# EAGLE design ADS1298_V1 (EAGLE 9.6.1)
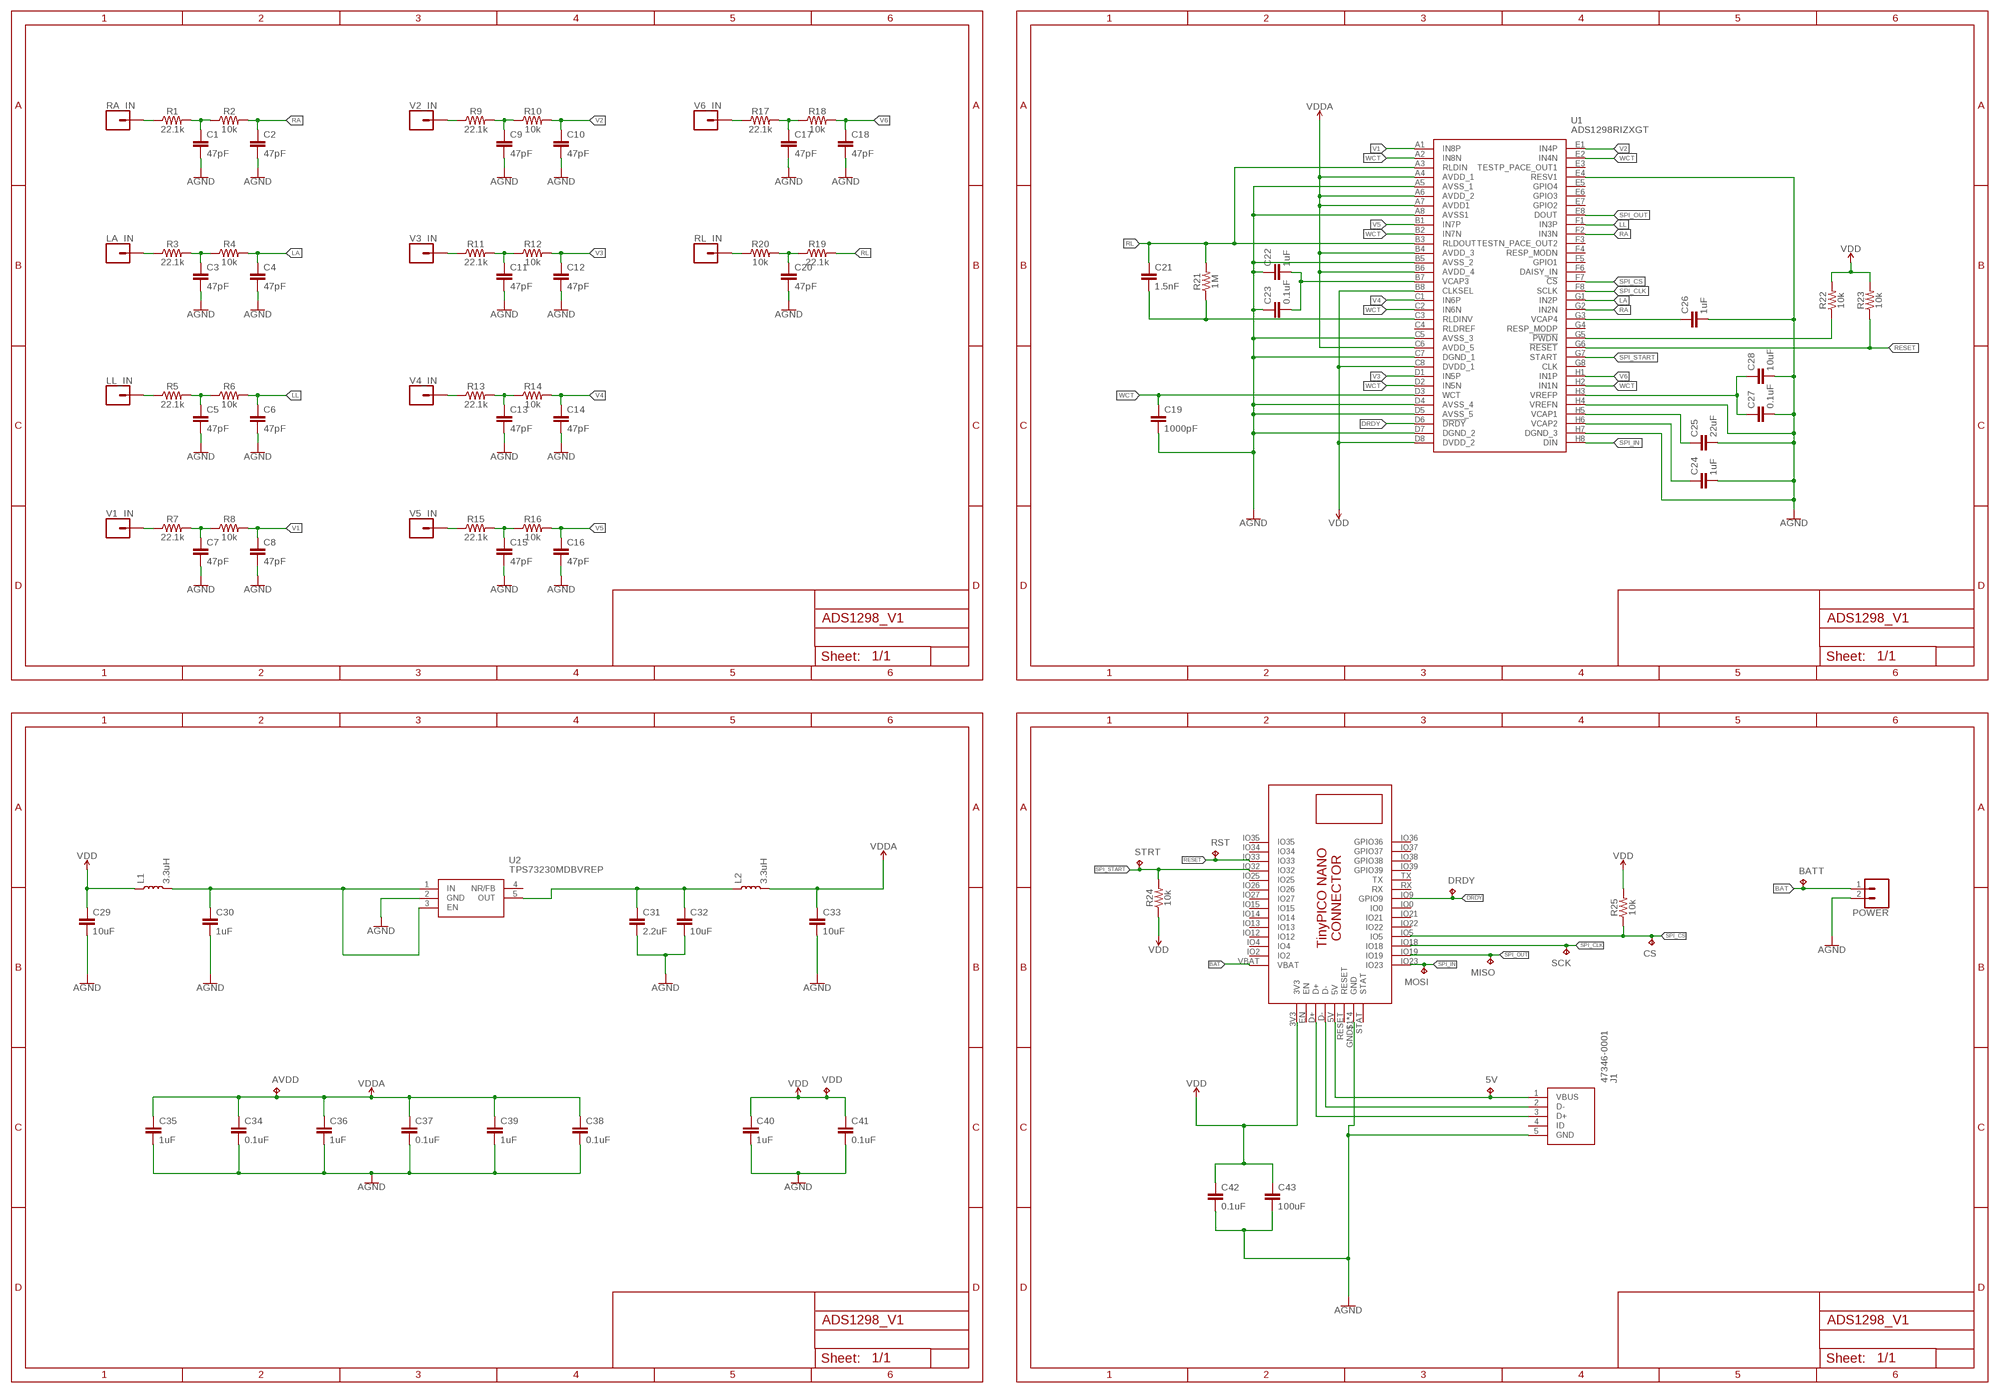
[diagram p0: schematic, sheet 1]

## Parts
5V  TPB1,27  [B1,27]
AVDD  TPB1,27  [B1,27]
BATT  TPB1,27  [B1,27]
C1  47pF  CAP-0603  [0603]
C2  47pF  CAP-0603  [0603]
C3  47pF  CAP-0603  [0603]
C4  47pF  CAP-0603  [0603]
C5  47pF  CAP-0603  [0603]
C6  47pF  CAP-0603  [0603]
C7  47pF  CAP-0603  [0603]
C8  47pF  CAP-0603  [0603]
C9  47pF  CAP-0603  [0603]
C10  47pF  CAP-0603  [0603]
C11  47pF  CAP-0603  [0603]
C12  47pF  CAP-0603  [0603]
C13  47pF  CAP-0603  [0603]
C14  47pF  CAP-0603  [0603]
C15  47pF  CAP-0603  [0603]
C16  47pF  CAP-0603  [0603]
C17  47pF  CAP-0603  [0603]
C18  47pF  CAP-0603  [0603]
C19  1000pF  CAP-0603  [0603]
C20  47pF  CAP-0603  [0603]
C21  1.5nF  CAP-0603  [0603]
C22  1uF  CAP-0603  [0603]
C23  0.1uF  CAP-0603  [0603]
C24  1uF  CAP-0603  [0603]
C25  22uF  CAP-0805  [0805]
C26  1uF  CAP-0603  [0603]
C27  0.1uF  CAP-0603  [0603]
C28  10uF  CAP-0805  [0805]
C29  10uF  CAP-0805  [0805]
C30  1uF  CAP-0603  [0603]
C31  2.2uF  CAP-0603  [0603]
C32  10uF  CAP-0805  [0805]
C33  10uF  CAP-0805  [0805]
C34  0.1uF  CAP-0603  [0603]
C35  1uF  CAP-0603  [0603]
C36  1uF  CAP-0603  [0603]
C37  0.1uF  CAP-0603  [0603]
C38  0.1uF  CAP-0603  [0603]
C39  1uF  CAP-0603  [0603]
C40  1uF  CAP-0603  [0603]
C41  0.1uF  CAP-0603  [0603]
C42  0.1uF  CAP-0603  [0603]
C43  100uF  CAP-0805  [0805]
CS  TPB1,27  [B1,27]
DRDY  TPB1,27  [B1,27]
J1  47346-0001  [47346-0001]
L1  3.3uH  INDUCTOR-0805-3.3UH  [0805]
L2  3.3uH  INDUCTOR-0805-3.3UH  [0805]
LA_IN  CONN_01  [1X01]
LL_IN  CONN_01  [1X01]
MISO  TPB1,27  [B1,27]
MOSI  TPB1,27  [B1,27]
POWER  CONN_02  [1X02]
R1  22.1k  RESISTOR0603  [0603]
R2  10k  RESISTOR0603  [0603]
R3  22.1k  RESISTOR0603  [0603]
R4  10k  RESISTOR0603  [0603]
R5  22.1k  RESISTOR0603  [0603]
R6  10k  RESISTOR0603  [0603]
R7  22.1k  RESISTOR0603  [0603]
R8  10k  RESISTOR0603  [0603]
R9  22.1k  RESISTOR0603  [0603]
R10  10k  RESISTOR0603  [0603]
R11  22.1k  RESISTOR0603  [0603]
R12  10k  RESISTOR0603  [0603]
R13  22.1k  RESISTOR0603  [0603]
R14  10k  RESISTOR0603  [0603]
R15  22.1k  RESISTOR0603  [0603]
R16  10k  RESISTOR0603  [0603]
R17  22.1k  RESISTOR0603  [0603]
R18  10k  RESISTOR0603  [0603]
R19  22.1k  RESISTOR0603  [0603]
R20  10k  RESISTOR0603  [0603]
R21  1M  RESISTOR0603  [0603]
R22  10k  RESISTOR0603  [0603]
R23  10k  RESISTOR0603  [0603]
R24  10k  RESISTOR0603  [0603]
R25  10k  RESISTOR0603  [0603]
RA_IN  CONN_01  [1X01]
RL_IN  CONN_01  [1X01]
RST  TPB1,27  [B1,27]
SCK  TPB1,27  [B1,27]
STRT  TPB1,27  [B1,27]
U1  ADS1298RIZXGT  [BGA64C80P8X8_800X800X145]
U2  TPS73230MDBVREP  [SOT95P280X145-5N]
U3  TINYPICO-NANO-CONNECTOR  [TINYPICO-NANO-CONNECTOR]
V1_IN  CONN_01  [1X01]
V2_IN  CONN_01  [1X01]
V3_IN  CONN_01  [1X01]
V4_IN  CONN_01  [1X01]
V5_IN  CONN_01  [1X01]
V6_IN  CONN_01  [1X01]
VDD  TPB1,27  [B1,27]

## Nets
AGND: C1.2 C2.2 C3.2 C4.2 C5.2 C6.2 C7.2 C8.2 C9.2 C10.2 C11.2 C12.2 C13.2 C14.2 C15.2 C16.2 C17.2 C18.2 C19.2 C20.2 C22.1 C23.1 C24.2 C25.2 C26.2 C27.2 C28.2 C29.2 C30.2 C31.2 C32.2 C33.2 C34.2 C35.2 C36.2 C37.2 C38.2 C39.2 C40.2 C41.2 C42.2 C43.2 J1.5(GND) POWER.2 U1.A5(AVSS_1) U1.A8(AVSS1) U1.B5(AVSS_2) U1.C5(AVSS_3) U1.C7(DGND_1) U1.D4(AVSS_4) U1.D5(AVSS_5) U1.D7(DGND_2) U1.E4(RESV1) U1.H4(VREFN) U1.H7(DGND_3) U2.2(GND) U3.GND$1(GND) U3.GND$2(GND) U3.GND$3(GND) U3.GND$4(GND)
BAT: BATT.TP POWER.1 U3.VBAT
DRDY: DRDY.TP U1.D6(!DRDY) U3.IO9(GPIO9)
LA: C4.1 R4.2 U1.G1(IN2P)
LL: C6.1 R6.2 U1.F1(IN3P)
N$1: R1.1 RA_IN.1
N$2: C1.1 R1.2 R2.1
N$3: LA_IN.1 R3.1
N$4: C3.1 R3.2 R4.1
N$5: LL_IN.1 R5.1
N$6: C5.1 R5.2 R6.1
N$7: R7.1 V1_IN.1
N$8: C7.1 R7.2 R8.1
N$9: R9.1 V2_IN.1
N$10: C9.1 R9.2 R10.1
N$11: R11.1 V3_IN.1
N$12: C11.1 R11.2 R12.1
N$13: R13.1 V4_IN.1
N$14: C13.1 R13.2 R14.1
N$15: R15.1 V5_IN.1
N$16: C15.1 R15.2 R16.1
N$17: R17.1 V6_IN.1
N$18: C17.1 R17.2 R18.1
N$19: R20.1 RL_IN.1
N$20: C20.1 R19.1 R20.2
N$21: C21.2 R21.1 U1.C3(RLDINV)
N$22: C22.2 C23.2 U1.B7(VCAP3)
N$23: R22.1 U1.G5(!PWDN)
N$24: C24.1 U1.H6(VCAP2)
N$25: C27.1 C28.1 U1.H3(VREFP)
N$26: C25.1 U1.H5(VCAP1)
N$27: C26.1 U1.G3(VCAP4)
N$29: C31.1 C32.1 L2.1 U2.5(OUT)
N$30: J1.3(D+) U3.D+
N$31: J1.2(D-) U3.D-
N$32: 5V.TP J1.1(VBUS) U3.5V
N$33: C30.1 L1.2 U2.1(IN) U2.3(EN)
RA: C2.1 R2.2 U1.F2(IN3N) U1.G2(IN2N)
RESET: R23.1 RST.TP U1.G6(!RESET) U3.IO33
RL: C21.1 R19.2 R21.2 U1.A3(RLDIN) U1.B3(RLDOUT)
SPI_CLK: SCK.TP U1.F8(SCLK) U3.IO18
SPI_CS: CS.TP R25.1 U1.F7(!CS) U3.IO5
SPI_IN: MOSI.TP U1.H8(DIN) U3.IO23
SPI_OUT: MISO.TP U1.E8(DOUT) U3.IO19
SPI_START: R24.2 STRT.TP U1.G7(START) U3.IO32
V1: C8.1 R8.2 U1.A1(IN8P)
V2: C10.1 R10.2 U1.E1(IN4P)
V3: C12.1 R12.2 U1.D1(IN5P)
V4: C14.1 R14.2 U1.C1(IN6P)
V5: C16.1 R16.2 U1.B1(IN7P)
V6: C18.1 R18.2 U1.H1(IN1P)
VDD: C29.1 C40.1 C41.1 C42.1 C43.1 L1.1 R22.2 R23.2 R24.1 R25.2 U1.B8(CLKSEL) U1.C8(DVDD_1) U1.D8(DVDD_2) U3.3V3 VDD.TP
VDDA: AVDD.TP C33.1 C34.1 C35.1 C36.1 C37.1 C38.1 C39.1 L2.2 U1.A4(AVDD_1) U1.A6(AVDD_2) U1.A7(AVDD1) U1.B4(AVDD_3) U1.B6(AVDD_4) U1.C6(AVDD_5)
WCT: C19.1 U1.A2(IN8N) U1.B2(IN7N) U1.C2(IN6N) U1.D2(IN5N) U1.D3(WCT) U1.E2(IN4N) U1.H2(IN1N)
Unconnected: J1.4(ID) U1.C4(RLDREF) U1.E3(TESTP_PACE_OUT1) U1.E5(GPIO4) U1.E6(GPIO3) U1.E7(GPIO2) U1.F3(TESTN_PACE_OUT2) U1.F4(RESP_MODN) U1.F5(GPIO1) U1.F6(DAISY_IN) U1.G4(RESP_MODP) U1.G8(CLK) U2.4(NR/FB) U3.EN U3.IO0 U3.IO2 U3.IO4 U3.IO12 U3.IO13 U3.IO14 U3.IO15 U3.IO21 U3.IO22 U3.IO25 U3.IO26 U3.IO27 U3.IO34 U3.IO35 U3.IO36(GPIO36) U3.IO37(GPIO37) U3.IO38(GPIO38) U3.IO39(GPIO39) U3.RESET U3.RX U3.STAT U3.TX

## Library data of the parts
5V AVDD BATT CS DRDY MISO MOSI RST SCK STRT VDD = testpad:TP: Test pad
C1-C43 = SparkFun-Capacitors:CAP
J1 = 47346-0001:47346-0001: Micro USB B Receptacle Bottom Mount Assy Molex Right Angle SMT Type B Version 2.0 Micro USB Connector Socket, 30 V ac, 1A 47352 MICRO-USB Source: Datasheet <http://www.molex.com/pdm_docs/sd/473460001_sd.pdf>; DESCRIPTION: Micro USB B Receptacle Bottom Mount Assy Molex Right Angle SMT Type B Version 2.0 Micro USB Connector Socket, 30 V ac, 1A 47352 MICRO-USB; HEIGHT: mm; MANUFACTURER_NAME: Molex; MANUFACTURER_PART_NUMBER: 47346-0001; MOUSER_PART_NUMBER: 538-47346-0001; MOUSER_PRICE-STOCK: https://www.mouser.co.uk/ProductDetail/Molex/47346-0001?qs=c2CV6XM0DweJBWaSeyWeCw%3D%3D
L1 L2 = SparkFun-Coils:INDUCTOR: Inductors Resist changes in electrical current. Basically a coil of wire. SparkFun Products: SparkFun Load Cell Amplifier - HX711 <https://www.sparkfun.com/products/13879> IOIO-OTG - V2.2 <https://www.sparkfun.com/products/13613>; PROD_ID: NDUC-13076; VALUE: 3.3µH/±20%/450mA
LA_IN LL_IN RA_IN RL_IN V1_IN V2_IN V3_IN V4_IN V5_IN V6_IN = SparkFun-Connectors:CONN_01: Single connection point. Often used as Generic Header-pin footprint for 0.1 inch spaced/style header connections On any of the 0.1 inch spaced packages, you can populate with these: Break Away Headers - Straight <https://www.sparkfun.com/products/116> (PRT-00116) Break Away Male Headers - Right Angle <https://www.sparkfun.com/products/553> (PRT-00553) Female Headers <https://www.sparkfun.com/products/115> (PRT-00115) Break Away Headers - Machine Pin <https://www.sparkfun.com/products/117> (PRT-00117) Break Away Female Headers - Swiss Machine Pin <https://www.sparkfun.com/products/743> (PRT-00743) This device is also useful as a general connection point to wire up your design to another part of your project. Our various solder wires solder well into these plated through hole pads. Hook-Up Wire - Assortment (Stranded, 22 AWG) <https://www.sparkfun.com/products/11375> (PRT-11375) Hook-Up Wire - Assortment (Solid Core, 22 AWG) <https://www.sparkfun.com/products/11367> (PRT-11367) View the entire wire category on our website here <https://www.sparkfun.com/categories/141> Special notes: SMTSO-256-ET is a "flush mount" nut for a 4-40 screw. We mostly use this on specialty testbeds; it is a nice way to connect hardware to your PCB at an adjustable hieght. Also note, the SNAP packages are for using a snappable style connector. We sell a baggie of snaps and they are also used on two LilyPad designs: Snap Assortment - 30 pack (male and female) <https://www.sparkfun.com/products/11347> (DEV-11347) LilyPad Arduino SimpleSnap <https://www.sparkfun.com/products/10941> (DEV-10941) LilyPad SimpleSnap Protoboard <https://www.sparkfun.com/products/10940> (DEV-10940)
POWER = SparkFun-Connectors:CONN_02: Multi connection point. Often used as Generic Header-pin footprint for 0.1 inch spaced/style header connections On any of the 0.1 inch spaced packages, you can populate with these: Break Away Headers - Straight <https://www.sparkfun.com/products/116> (PRT-00116) Break Away Male Headers - Right Angle <https://www.sparkfun.com/products/553> (PRT-00553) Female Headers <https://www.sparkfun.com/products/115> (PRT-00115) Break Away Headers - Machine Pin <https://www.sparkfun.com/products/117> (PRT-00117) Break Away Female Headers - Swiss Machine Pin <https://www.sparkfun.com/products/743> (PRT-00743) For SCREWTERMINALS and SPRING TERMINALS visit here: Screw Terimnals on SparkFun.com <https://www.sparkfun.com/search/results?term=Screw+Terminals> (5mm/3.5mm/2.54mm spacing) This device is also useful as a general connection point to wire up your design to another part of your project. Our various solder wires solder well into these plated through hole pads. Hook-Up Wire - Assortment (Stranded, 22 AWG) <https://www.sparkfun.com/products/11375> (PRT-11375) Hook-Up Wire - Assortment (Solid Core, 22 AWG) <https://www.sparkfun.com/products/11367> (PRT-11367) View the entire wire category on our website here <https://www.sparkfun.com/categories/141> Special notes: Molex polarized connector foot print use with: PRT-08233 with associated crimp pins and housings. 2.54_SCREWTERM for use with PRT-10571. 3.5mm Screw Terminal footprints for PRT-08084 5mm Screw Terminal footprints for use with PRT-08432
R1-R25 = SparkFun-Resistors:RESISTOR: Generic Resistor Package
U1 = ADS1298RIZXGT:ADS1298RIZXGT: 8-Channel, 24-Bit Analog-To-Digital Converter w/Integrated Respiration Impedance and ECG Front End Source: Datasheet <http://www.ti.com/lit/gpn/ads1298r>; ARROW_PART_NUMBER: ADS1298RIZXGT; ARROW_PRICE-STOCK: https://www.arrow.com/en/products/ads1298rizxgt/texas-instruments; DESCRIPTION: 8-Channel, 24-Bit Analog-To-Digital Converter w/Integrated Respiration Impedance and ECG Front End; HEIGHT: 1.45mm; MANUFACTURER_NAME: Texas Instruments; MANUFACTURER_PART_NUMBER: ADS1298RIZXGT; MOUSER_PART_NUMBER: 595-ADS1298RIZXGT; MOUSER_PRICE-STOCK: https://www.mouser.co.uk/ProductDetail/Texas-Instruments/ADS1298RIZXGT/?qs=QtI0yD1FyOMXYlOc8kA39w%3D%3D
U2 = TPS73230MDBVREP:TPS73230MDBVREP: Enhanced Product Cap-Free Nmos 250-Ma Ldo Regulator With Reverse Current Protection Source: Datasheet <http://www.ti.com/lit/gpn/tps73230-ep>; ARROW_PART_NUMBER: TPS73230MDBVREP; ARROW_PRICE-STOCK: https://www.arrow.com/en/products/tps73230mdbvrep/texas-instruments; DESCRIPTION: Enhanced Product Cap-Free Nmos 250-Ma Ldo Regulator With Reverse Current Protection; HEIGHT: 1.45mm; MANUFACTURER_NAME: Texas Instruments; MANUFACTURER_PART_NUMBER: TPS73230MDBVREP; MOUSER_PART_NUMBER: 595-TPS73230MDBVREP; MOUSER_PRICE-STOCK: https://www.mouser.com/Search/Refine.aspx?Keyword=595-TPS73230MDBVREP
U3 = TinyPICO_NANO_Eagle:TINYPICO-NANO-CONNECTOR: TinyPICO NANO Footprint https://www.tinypico.com/tinypico-nano

## Board
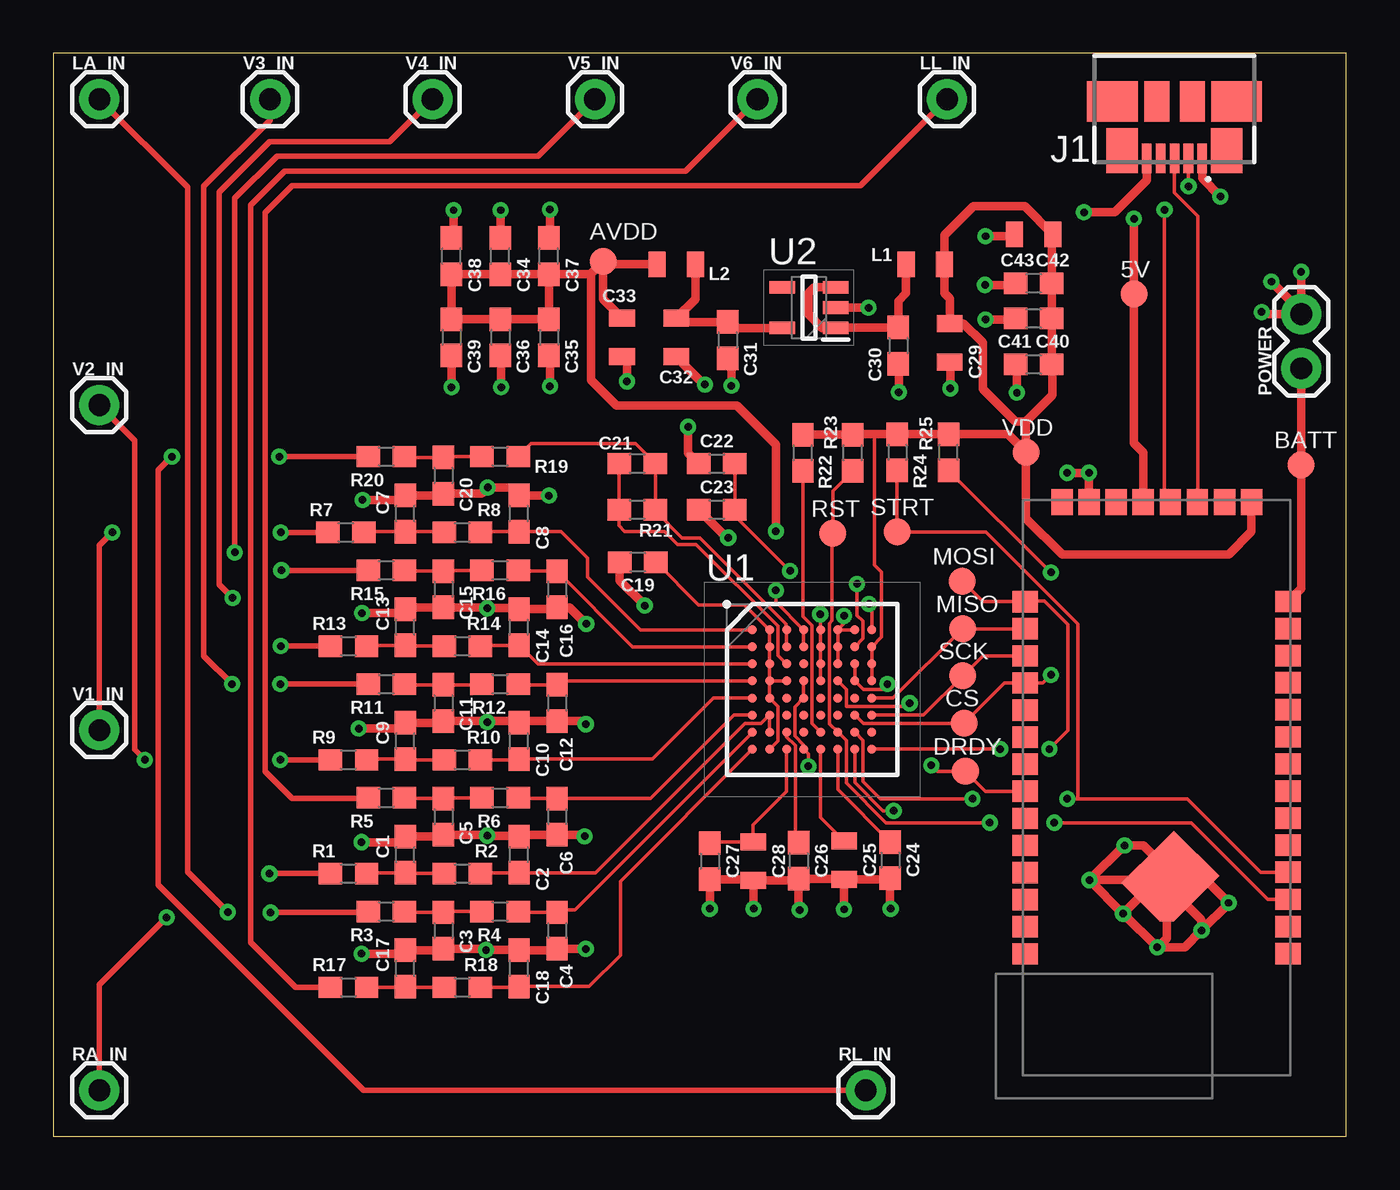
[diagram p1: board, top side]
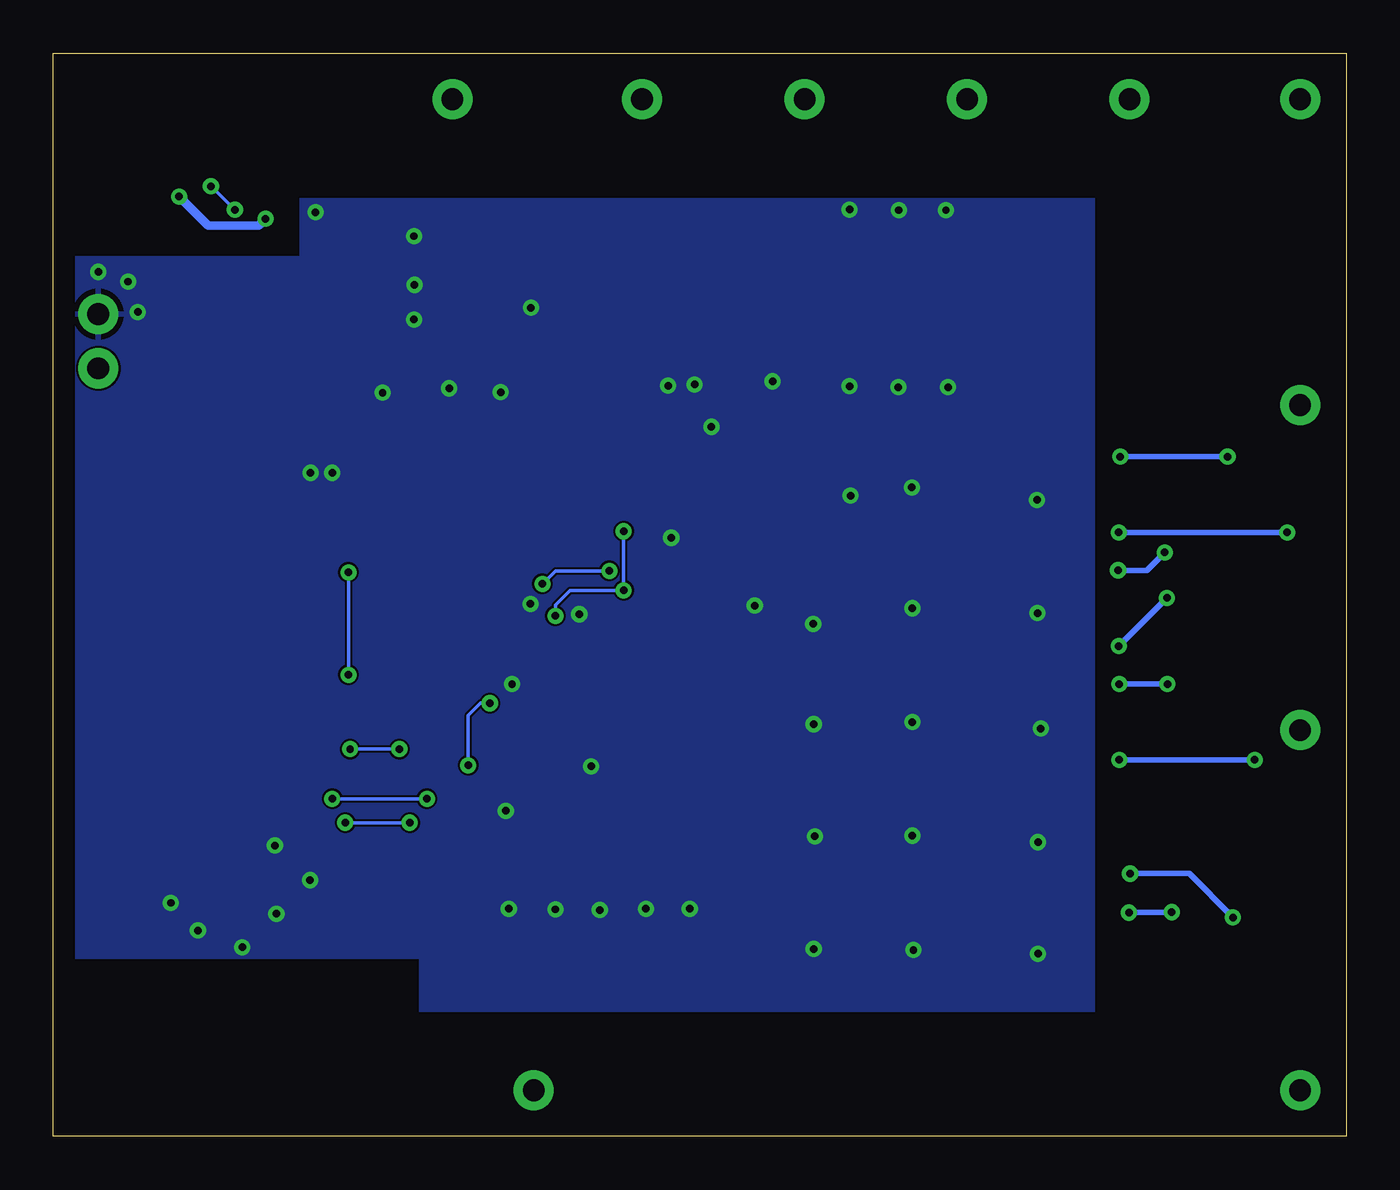
[diagram p2: board, bottom side, seen from below]

Size 60.63 x 50.79 mm. Coordinates in mm from the lower left corner, seen from the top.
Outline: 0,0 60.63,0 60.63,50.79 0,50.79 0,0
Copper layers (1*16): Top 0.035mm / dielectric 1.5mm / Bottom 0.035mm
Design rules "default *": minimum track width 6mil, minimum drill 0.35mm, track to track 4mil, track to pad 4mil, pad to pad 4mil, via to via 4mil, smd to smd 4mil, copper to edge 40mil, drill to drill 6mil, minimum pad ring 10mil, minimum via ring 8mil, stop-mask expansion 4mil, vias tented up to drill 0mil, thermal gap 10mil

### Footprints (pad centres in the part's own frame; a part is rotated, then mirrored left to right if it is on the bottom)
B1,27 = smd 1.27 x 1.27: TP 0,0
0603 = smd 1.1 x 1: 1 -0.85,0; 2 0.85,0
0805 = smd 0.8 x 1.2: 1 -0.9,0; 2 0.9,0
47346-0001 = smd 0.45 x 1.38: 1 1.3,-4.81; 2 0.65,-4.81; 3 0,-4.81; 4 -0.65,-4.81; 5 -1.3,-4.81 | smd 1.475 x 2.1: 6 -2.453,-4.45; 7 2.453,-4.45 | smd 1.175 x 1.9: 8 0.838,-2.15; 9 -0.838,-2.15 | smd 2.375 x 1.9: 10 2.913,-2.15; 11 -2.913,-2.15
1X01 = drill 1.016 pad 1.88: 1 0,0
1X02 = drill 1.016 pad 1.88: 1 0,0; 2 2.54,0
BGA64C80P8X8_800X800X145 = smd 0.418 x 0.418: A1 -2.8,2.8; A2 -2,2.8; A3 -1.2,2.8; A4 -0.4,2.8; A5 0.4,2.8; A6 1.2,2.8; A7 2,2.8; A8 2.8,2.8; B1 -2.8,2; B2 -2,2; B3 -1.2,2; B4 -0.4,2; B5 0.4,2; B6 1.2,2; B7 2,2; B8 2.8,2; C1 -2.8,1.2; C2 -2,1.2; C3 -1.2,1.2; C4 -0.4,1.2; C5 0.4,1.2; C6 1.2,1.2; C7 2,1.2; C8 2.8,1.2; D1 -2.8,0.4; D2 -2,0.4; D3 -1.2,0.4; D4 -0.4,0.4; D5 0.4,0.4; D6 1.2,0.4; D7 2,0.4; D8 2.8,0.4; E1 -2.8,-0.4; E2 -2,-0.4; E3 -1.2,-0.4; E4 -0.4,-0.4; E5 0.4,-0.4; E6 1.2,-0.4; E7 2,-0.4; E8 2.8,-0.4; F1 -2.8,-1.2; F2 -2,-1.2; F3 -1.2,-1.2; F4 -0.4,-1.2; F5 0.4,-1.2; F6 1.2,-1.2; F7 2,-1.2; F8 2.8,-1.2; G1 -2.8,-2; G2 -2,-2; G3 -1.2,-2; G4 -0.4,-2; G5 0.4,-2; G6 1.2,-2; G7 2,-2; G8 2.8,-2; H1 -2.8,-2.8; H2 -2,-2.8; H3 -1.2,-2.8; H4 -0.4,-2.8; H5 0.4,-2.8; H6 1.2,-2.8; H7 2,-2.8; H8 2.8,-2.8
SOT95P280X145-5N = smd 1.2 x 0.6: 1 -1.25,0.95; 2 -1.25,0; 3 -1.25,-0.95; 4 1.25,-0.95; 5 1.25,0.95
TINYPICO-NANO-CONNECTOR = smd 1.2 x 1: 3V3 0.1,10.725; 5V 0.1,5.645; D+ 0.1,8.185; D- 0.1,6.915; EN 0.1,9.455; GND$1 0.1,3.105; RESET 0.1,4.375; STAT 0.1,1.835 | smd 3 x 3 rotated 45: GND$2 17.643,7.082 | smd 0.66 x 0.671: GND$3 19.436,6.746 | smd 2.54 x 2.54 rotated 45: GND$4 17.971,6.413 | smd 1 x 1.2: IO0 12.395,0.1; IO2 6.034,12.44; IO4 7.304,12.44; IO5 8.585,0.1; IO9 13.665,0.1; IO12 8.574,12.44; IO13 9.844,12.44; IO14 11.114,12.44; IO15 12.384,12.44; IO18 7.315,0.1; IO19 6.045,0.1; IO21 11.125,0.1; IO22 9.855,0.1; IO23 4.775,0.1; IO25 16.194,12.44; IO26 14.924,12.44; IO27 13.654,12.44; IO32 17.464,12.44; IO33 18.734,12.44; IO34 20.004,12.44; IO35 21.274,12.44; IO36 21.285,0.1; IO37 20.015,0.1; IO38 18.745,0.1; IO39 17.475,0.1; RX 14.935,0.1; TX 16.205,0.1; VBAT 4.764,12.44

### Placement (x,y rotation side)
5V  50.67,39.5 0 top
AVDD  25.78,41.02 0 top
BATT  58.52,31.5 0 top
C1  16.51,13.21 90 top
C2  21.84,13.21 90 top
C3  18.29,9.65 270 top
C4  23.62,9.65 270 top
C5  18.29,14.99 270 top
C6  23.62,14.99 270 top
C7  16.51,29.21 90 top
C8  21.84,29.21 90 top
C9  16.51,18.54 90 top
C10  21.84,18.54 90 top
C11  18.29,20.32 270 top
C12  23.62,20.32 270 top
C13  16.51,23.88 90 top
C14  21.84,23.88 90 top
C15  18.29,25.65 270 top
C16  23.62,25.65 270 top
C17  16.51,7.87 90 top
C18  21.84,7.87 90 top
C19  27.41,26.92 180 top
C20  18.29,30.99 270 top
C21  27.38,31.55 180 top
C22  31.11,31.55 0 top
C23  31.11,29.39 0 top
C24  39.24,12.95 270 top
C25  37.08,12.95 270 top
C26  34.95,12.93 270 top
C27  30.78,12.9 270 top
C28  32.82,12.9 270 top
C29  42.04,37.21 270 top
C30  39.62,37.08 270 top
C31  31.62,37.34 270 top
C32  29.21,37.47 270 top
C33  26.67,37.47 270 top
C34  20.95,41.27 90 top
C35  23.24,37.47 270 top
C36  20.95,37.47 270 top
C37  23.24,41.27 90 top
C38  18.67,41.27 90 top
C39  18.67,37.47 270 top
C40  45.97,36.2 180 top
C41  45.97,38.35 180 top
C42  45.97,40.01 180 top
C43  45.97,42.29 180 top
CS  42.72,19.38 0 top
DRDY  42.77,17.12 0 top
J1  52.58,50.67 0 top
L1  40.89,40.89 180 top
L2  29.21,40.89 180 top
LA_IN  2.16,48.64 0 top
LL_IN  41.91,48.64 0 top
MISO  42.65,23.8 0 top
MOSI  42.62,26.04 0 top
POWER  58.52,36.02 90 top
R1  13.84,12.32 0 top
R2  19.18,12.32 0 top
R3  15.62,10.54 0 top
R4  20.95,10.54 0 top
R5  15.62,15.88 0 top
R6  20.95,15.88 0 top
R7  13.72,28.32 0 top
R8  19.18,28.32 0 top
R9  13.84,17.65 0 top
R10  19.18,17.65 0 top
R11  15.62,21.21 0 top
R12  20.95,21.21 0 top
R13  13.84,22.99 0 top
R14  19.18,22.99 0 top
R15  15.62,26.54 0 top
R16  20.95,26.54 0 top
R17  13.84,6.99 0 top
R18  19.18,6.99 0 top
R19  20.95,31.88 0 top
R20  15.62,31.88 0 top
R21  27.38,29.39 0 top
R22  35.15,32.05 90 top
R23  37.49,32.05 90 top
R24  39.57,32.08 270 top
R25  41.99,32.08 90 top
RA_IN  2.16,2.16 0 top
RL_IN  38.1,2.16 0 top
RST  36.55,28.27 0 top
SCK  42.65,21.59 0 top
STRT  39.57,28.35 0 top
U1  35.59,20.95 0 top
U2  35.43,38.86 180 top
U3  45.47,29.84 270 top
V1_IN  2.16,19.05 0 top
V2_IN  2.16,34.29 0 top
V3_IN  10.16,48.64 0 top
V4_IN  17.78,48.64 0 top
V5_IN  25.4,48.64 0 top
V6_IN  33.02,48.64 0 top
VDD  45.62,32.08 0 top

### Tracks (layer width: path | path; a pad name or v marks a point on that pad's centre or on a via)
AGND  (via drill 0.35)
  Top 0.152: U1.D5 U1.C5 U1.B5 U1.A5 35.98,24.47 v35.97,24.49 | U1.D4 U1.E4 34.77,20.14 34.77,18.77 35.19,18.36 U1.H4 35.41,17.93 v35.41,17.35 | U1.H7 37.59,16.59 38.91,15.27 v39.41,15.27 | U1.C7 U1.D7 37.98,20.95 38.86,20.95 v39.12,21.21 | U1.A8 38.38,24.84 v38.25,24.97
  Top 0.406: v53.85,9.65 53.85,10.16 52.13,11.87 U3.GND$4 51.6,11.87 | v51.77,8.87 51.79,8.87 52.21,9.29 U3.GND$3 | v55.12,10.95 | v55.12,10.95 53.87,12.2 U3.GND$2 51.11,13.64 v50.24,13.64 50.22,13.64 v48.59,12.01 | v50.16,10.44 51.6,11.87 | v48.59,12.01 51.46,12.01 51.6,11.87 | v48.59,12.01 v50.16,10.44 | v50.16,10.44 50.19,10.44 v51.77,8.87 | v51.77,8.87 53.06,8.87 v53.85,9.65 | v53.85,9.65 55.12,10.93 v55.12,10.95 | C28.2 32.77,12.05 C27.2 v30.79,10.67 | C28.2 34.88,12 C26.2 | C26.2 37.06,12.08 C25.2 | C25.2 39.19,12.05 C24.2 39.24,10.69 v39.27,10.67 | C28.2 32.84,11.98 v32.84,10.67 | C26.2 34.95,10.67 v35,10.62 | C25.2 v37.08,10.64 | v24.97,8.79 24.95,8.8 C4.2 23.54,8.72 C18.2 21.83,8.74 v20.3,8.74 20.23,8.8 C3.2 18.21,8.72 C17.2 16.35,8.56 v14.45,8.56 | C2.2 21.88,14.1 | v24.92,14.07 24.85,14.14 C6.2 21.92,14.14 21.88,14.1 | v14.45,13.79 16.24,13.79 C1.2 18.21,14.06 C5.2 20.31,14.14 v20.34,14.1 21.88,14.1 | v14.33,19.13 16.24,19.13 C9.2 18.21,19.39 C11.2 20.31,19.47 v20.34,19.43 20.38,19.47 21.92,19.47 | C10.2 21.92,19.47 | 21.92,19.47 C12.2 24.83,19.47 v24.97,19.33 | v24.99,24.03 24.22,24.8 C16.2 23.54,24.73 22.12,24.73 | C14.2 22.12,24.73 | v14.48,24.54 16.32,24.54 C13.2 16.59,24.8 C15.2 20.31,24.8 v20.34,24.77 22.08,24.77 22.12,24.73 | C8.2 22.07,30.06 | 22.07,30.06 23.23,30.06 v23.24,30.05 | v14.5,29.84 16.3,29.84 C7.2 18.21,30.06 C20.2 20.08,30.14 v20.37,30.43 21.7,30.43 22.07,30.06 | C19.2 26.56,26.07 v27.74,24.89 | C23.1 31.59,28.07 v31.65,28.07 | C22.1 29.77,32.04 v29.77,33.27 | C39.2 v18.67,35.13 | C36.2 21.01,36.56 v21.01,35.13 | C35.2 23.29,36.56 v23.29,35.18 | C38.2 18.77,42.23 v18.77,43.43
  Top 0.406: C34.2 20.98,42.15 v20.98,43.43 | C37.2 23.29,42.18 v23.29,43.46 | C33.2 26.9,36.34 v26.9,35.41 | C32.2 30.52,35.26 v30.56,35.26 | C31.2 31.8,36.31 v31.8,35.2 | C30.2 39.65,36.21 v39.65,34.9 | C29.2 42.06,36.29 v42.06,35.08 | C40.2 45.19,36.13 v45.19,34.87 | C43.2 45,42.22 v43.71,42.22 | C42.2 45.05,39.93 v43.69,39.93 | C41.2 45.07,38.3 v43.71,38.3 | U3.GND$1 v48.57,31.11 v48.56,31.11 v47.55,31.11 | J1.5 51.28,44.84 51.28,44.83 49.78,43.33 v48.34,43.33 | U2.2 v38.23,38.86 | POWER.2 56.77,38.56 v56.67,38.66 | POWER.2 v58.52,40.54 | POWER.2 58.52,38.68 v57.12,40.08
  pour Bottom: 11.81,5.84 43.46,5.84 43.46,8.33 60.5,8.33 60.5,41.27 49.05,41.27 49.05,43.99 41.22,43.99 11.81,43.99
BAT
  Top 0.406: POWER.1 BATT.TP 58.52,25.7 U3.VBAT
DRDY  (via drill 0.35)
  Top 0.152: U1.D6 37.19,20.95 37.19,20.17 40.01,20.17 v40.16,20.31 | v41.17,17.4 41.45,17.12 DRDY.TP 43.71,16.18 U3.IO9
  Bottom 0.152: v40.16,20.31 40.6,20.31 41.17,19.74 v41.17,17.4
LA
  Top 0.152: U1.G1 32.78,18.93 24.47,10.62 23.74,10.62 C4.1 21.84,10.5 R4.2
LL
  Top 0.152: U1.F1 31.93,19.76 28,15.84 C6.1 21.84,15.84 R6.2
N$1  (via drill 0.35)
  Top 0.254: RA_IN.1 2.16,7.11 v5.31,10.26 | v10.13,12.32 R1.1
  Bottom 0.254: v5.31,10.26 7.37,12.32 v10.13,12.32
N$2
  Top 0.152: R2.1 16.55,12.32 C1.1 14.73,12.36 R1.2
N$3  (via drill 0.35)
  Top 0.254: LA_IN.1 6.3,44.5 6.3,12.39 v8.18,10.52 | R3.1 14.72,10.49 v10.19,10.49
  Bottom 0.254: v10.19,10.49 8.2,10.49 v8.18,10.52
N$4
  Top 0.152: R4.1 18.33,10.54 C3.1 16.51,10.5 R3.2
N$5
  Top 0.254: LL_IN.1 37.85,44.58 11.2,44.58 9.93,43.31 9.93,17.12 11.2,15.85 14.75,15.85 R5.1
N$6
  Top 0.152: R6.1 18.33,15.88 C5.1 16.51,15.84 R5.2
N$7  (via drill 0.35)
  Top 0.254: V1_IN.1 2.16,27.71 v2.77,28.32 | v10.67,28.32 R7.1
  Bottom 0.254: v2.77,28.32 v10.67,28.32
N$8
  Top 0.152: R8.1 18.29,28.36 C7.1 14.61,28.36 R7.2
N$9  (via drill 0.35)
  Top 0.254: V2_IN.1 3.81,32.64 3.81,18.14 v4.29,17.65 | v10.64,17.65 R9.1
  Bottom 0.254: v4.29,17.65 v10.64,17.65
N$10
  Top 0.152: R10.1 16.55,17.65 C9.1 14.73,17.69 R9.2
N$11  (via drill 0.35)
  Top 0.254: V3_IN.1 10.16,47.65 7.06,44.55 7.06,22.53 v8.38,21.21 | v10.64,21.21 R11.1
  Bottom 0.254: v10.64,21.21 v8.38,21.21
N$12
  Top 0.152: R12.1 20.07,21.17 C11.1 16.51,21.17 R11.2
N$13  (via drill 0.35)
  Top 0.254: V4_IN.1 15.77,46.63 10.13,46.63 7.77,44.27 7.77,25.88 v8.41,25.25 | v10.67,22.99 R13.1
  Bottom 0.254: v10.67,22.99 v8.41,25.25
N$14
  Top 0.152: R14.1 16.55,22.99 C13.1 14.73,23.03 R13.2
N$15  (via drill 0.35)
  Top 0.254: V5_IN.1 22.73,45.97 10.49,45.97 8.51,43.99 v8.51,27.38 | v10.69,26.54 R15.1
  Bottom 0.254: v10.69,26.54 9.35,26.54 v8.51,27.38
N$16
  Top 0.152: R16.1 18.33,26.54 C15.1 16.51,26.5 R15.2
N$17
  Top 0.254: V6_IN.1 29.64,45.26 10.85,45.26 9.25,43.66 9.25,9.11 11.37,6.99 R17.1
N$18
  Top 0.152: R18.1 16.55,6.99 C17.1 16.47,6.99 R17.2
N$19  (via drill 0.35)
  Top 0.254: RL_IN.1 14.55,2.16 4.93,11.79 4.93,31.24 v5.56,31.88 | v10.59,31.88 R20.1
  Bottom 0.254: v5.56,31.88 v10.59,31.88
N$20
  Top 0.152: R19.1 18.33,31.88 C20.1 16.51,31.84 R20.2
N$21
  Top 0.152: U1.C3 33.98,22.55 33.98,23.93 30.15,27.76 29.26,27.76 28.65,28.37 26.8,28.37 26.53,28.64 R21.1 C21.2
N$22  (via drill 0.35)
  Top 0.152: U1.B7 37.97,23.34 37.97,24.16 37.69,24.43 v37.69,25.91 | v34.55,26.52 31.96,29.1 C23.2 C22.2
  Bottom 0.152: v37.69,25.91 37.08,26.52 v34.55,26.52
N$23
  Top 0.152: U1.G5 35.59,19.36 35.59,23.95 35.15,24.38 R22.1
N$24
  Top 0.152: C24.1 36.78,16.26 U1.H6
N$25
  Top 0.152: U1.H3 34.38,16.17 32.82,14.61 C28.1 30.84,13.8 C27.1
N$26
  Top 0.152: C25.1 35.98,14.95 U1.H5
N$27
  Top 0.152: U1.G3 34.38,18.73 34.8,18.32 34.8,13.93 C26.1
N$29
  Top 0.406: U2.5 31.9,37.91 C31.1 29.39,38.19 C32.1 30.11,39.27 L2.1
N$30
  Top 0.152: J1.3 52.58,44.25 53.67,43.16 53.67,29.76 U3.D+
N$31  (via drill 0.35)
  Top 0.152: J1.2 53.23,44.56 v53.24,44.55 | v52.11,43.45 52.11,30.02 U3.D-
  Bottom 0.152: v53.24,44.55 52.14,43.45 v52.11,43.45
N$32  (via drill 0.35)
  Top 0.406: J1.1 53.88,44.92 v54.73,44.07 | v50.67,43.03 5V.TP 50.67,32.51 51.11,32.07 U3.5V
  Bottom 0.406: v54.73,44.07 53.36,42.7 51,42.7 v50.67,43.03
N$33
  Top 0.406: L1.2 39.99,39.54 39.62,39.17 C30.1 36.7,37.93 U2.1 36.05,37.91 35.41,38.56 35.41,39.55 35.69,39.83 36.67,39.83 U2.3
RA
  Top 0.152: U1.G2 U1.F2 33.19,19.36 32.44,19.36 25.44,12.36 C2.1 20.07,12.36 R2.2
RESET  (via drill 0.35)
  Top 0.152: v46.94,14.71 53.37,14.71 56.96,11.11 U3.IO33 | v43.92,14.71 39.04,14.71 37.19,16.56 37.19,18.55 U1.G6 36.4,19.34 36.4,24.05 36.52,24.18 36.52,28.25 RST.TP 36.55,30.27 R23.1
  Bottom 0.152: v46.94,14.71 v43.92,14.71
RL
  Top 0.152: U1.B3 U1.A3 34.37,23.77 34.37,24.02 30.32,28.07 29.49,28.07 28.23,29.32 R21.2 C21.1 27.29,32.49 22.41,32.49 R19.2
SPI_CLK
  Top 0.152: U1.F8 40.81,19.75 SCK.TP 43.59,22.53 U3.IO18
SPI_CS  (via drill 0.35)
  Top 0.152: U1.F7 37.99,19.36 42.7,19.36 CS.TP 44.6,21.26 U3.IO5 46.41,21.26 v46.79,21.64 | R25.1 46.77,26.44 v46.79,26.44
  Bottom 0.152: v46.79,26.44 v46.79,21.64
SPI_IN  (via drill 0.35)
  Top 0.152: U1.H8 v44.39,18.16 v44.4,18.16 | v46.71,18.16 47.57,19.02 47.57,24 46.48,25.09 45.59,25.09 U3.IO23 43.59,25.07 MOSI.TP
  Bottom 0.152: v44.4,18.16 v46.71,18.16
SPI_OUT
  Top 0.152: U1.E8 39.38,20.55 42.62,23.8 MISO.TP U3.IO19
SPI_START  (via drill 0.35)
  Top 0.152: U1.G7 37.97,18.57 37.97,16.64 38.79,15.82 v43.1,15.82 | v47.55,15.82 48.06,15.82 | 48.06,15.82 53.19,15.82 56.63,12.38 U3.IO32 | R24.2 STRT.TP 43.74,28.35 48.06,24.03 48.06,15.82
  Bottom 0.152: v43.1,15.82 v47.55,15.82
V1
  Top 0.152: U1.A1 27.53,23.75 25.04,26.24 25.04,27.13 23.81,28.36 C8.1 20.07,28.36 R8.2
V2
  Top 0.152: U1.E1 30.97,20.55 28.11,17.69 C10.1 21.8,17.65 R10.2
V3
  Top 0.152: U1.D1 23.81,21.36 C12.1 21.84,21.17 R12.2
V4
  Top 0.152: U1.C1 22.72,22.15 C14.1 20.07,23.03 R14.2
V5
  Top 0.152: U1.B1 27.17,22.95 C16.1 21.84,26.5 R16.2
V6
  Top 0.152: U1.H1 26.59,11.96 26.59,8.48 25.13,7.02 C18.1 21.8,6.99 R18.2
VDD
  Top 0.152: U1.D8 U1.C8 U1.B8 38.84,23.41 38.84,26.47 38.51,26.8 38.51,32.91 38.53,32.93
  Top 0.406: U3.3V3 56.19,28.35 55.12,27.28 47.32,27.28 45.62,28.98 VDD.TP | VDD.TP 45.62,33.53 | 45.62,33.53 46.86,34.77 46.86,36.16 C40.1 C41.1 C42.1 46.82,42.24 C43.1 45.55,43.61 43.16,43.61 41.79,42.25 L1.1 41.79,39.54 42.04,39.29 C29.1 42.69,38.11 43.59,37.21 43.59,35.05 45.11,33.53 45.62,33.53 | VDD.TP 44.77,32.93 R25.2 R24.1 38.53,32.93 37.52,32.93 R23.2 R22.2
VDDA  (via drill 0.35)
  Top 0.152: U1.C6 U1.B6 U1.A6 | U1.A7 U1.A6 | U1.B4 U1.A4 33.88,25.06 v33.88,25.6 | U1.A6 37.08,24.05 v37.08,24.41
  Top 0.406: L2.2 25.91,40.89 AVDD.TP | AVDD.TP 25.78,39.25 C33.1 | AVDD.TP 25.18,40.42 | C37.1 25.18,40.42 | C37.1 C34.1 C38.1 C39.1 C36.1 C35.1 C37.1 | 25.18,40.42 25.22,40.39 25.22,35.46 26.42,34.27 32.05,34.27 33.88,32.44 v33.88,28.37
  Bottom 0.152: v37.08,24.41 37.08,24.92 36.4,25.6 v33.88,25.6 v33.88,28.37
WCT
  Top 0.152: U1.D2 U1.C2 U1.B2 U1.A2 32.42,24.92 30.26,24.92 C19.1 | U1.D2 U1.D3 | U1.D2 U1.E2 33.98,20.16 33.98,18.54 U1.H2